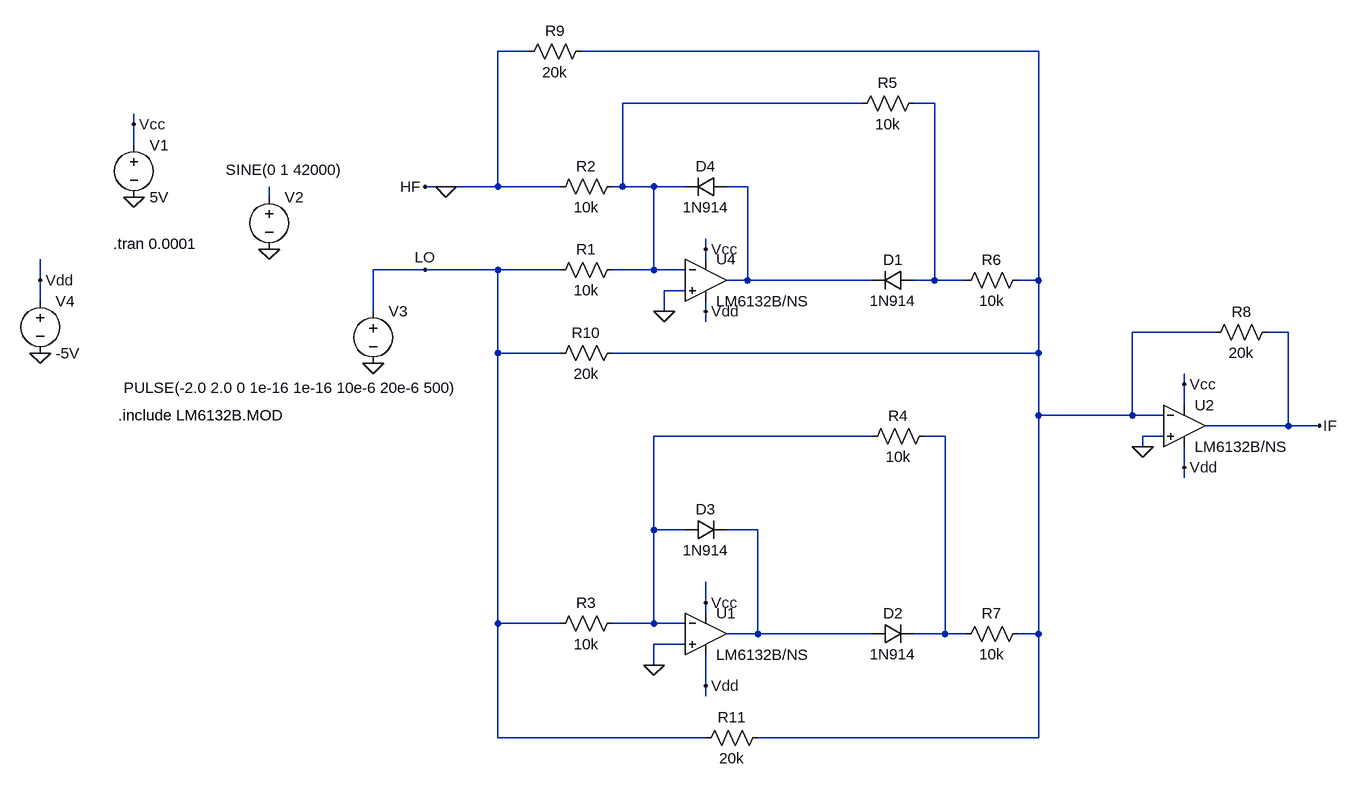
[diagram p0: schematic opamp_mixer.asc]
opamp_mixer.asc, the LTspice schematic file:
Version 4
SHEET 1 1280 752
WIRE -128 -352 -176 -352
WIRE 656 -352 -48 -352
WIRE 384 -272 16 -272
WIRE 496 -272 464 -272
WIRE -736 -240 -736 -256
WIRE -736 -208 -736 -240
WIRE -256 -144 -288 -144
WIRE -176 -144 -176 -352
WIRE -176 -144 -256 -144
WIRE -80 -144 -176 -144
WIRE 16 -144 16 -272
WIRE 16 -144 0 -144
WIRE 64 -144 16 -144
WIRE 112 -144 64 -144
WIRE 208 -144 176 -144
WIRE -528 -128 -528 -144
WIRE 144 -48 144 -64
WIRE 144 -32 144 -48
WIRE -288 -16 -368 -16
WIRE -176 -16 -288 -16
WIRE -80 -16 -176 -16
WIRE 64 -16 64 -144
WIRE 64 -16 0 -16
WIRE 112 -16 64 -16
WIRE -880 0 -880 -32
WIRE 208 0 208 -144
WIRE 208 0 176 0
WIRE 400 0 208 0
WIRE 496 0 496 -272
WIRE 496 0 464 0
WIRE 544 0 496 0
WIRE 656 0 656 -352
WIRE 656 0 624 0
WIRE 112 16 80 16
WIRE -880 32 -880 0
WIRE -368 48 -368 -16
WIRE 80 48 80 16
WIRE 144 48 144 32
WIRE 144 64 144 48
WIRE 928 80 800 80
WIRE 1040 80 1008 80
WIRE -176 112 -176 -16
WIRE -80 112 -176 112
WIRE 656 112 656 0
WIRE 656 112 0 112
WIRE 880 160 880 144
WIRE 880 192 880 160
WIRE 656 208 656 112
WIRE 800 208 800 80
WIRE 800 208 656 208
WIRE 848 208 800 208
WIRE 1040 224 1040 80
WIRE 1040 224 912 224
WIRE 1088 224 1040 224
WIRE 400 240 64 240
WIRE 512 240 480 240
WIRE 848 240 816 240
WIRE 816 256 816 240
WIRE 880 288 880 256
WIRE 880 304 880 288
WIRE 64 384 64 240
WIRE 112 384 64 384
WIRE 224 384 176 384
WIRE 144 496 144 464
WIRE 144 512 144 496
WIRE -176 528 -176 112
WIRE -80 528 -176 528
WIRE 64 528 64 384
WIRE 64 528 0 528
WIRE 112 528 64 528
WIRE 224 544 224 384
WIRE 224 544 176 544
WIRE 400 544 224 544
WIRE 512 544 512 240
WIRE 512 544 464 544
WIRE 544 544 512 544
WIRE 656 544 656 208
WIRE 656 544 624 544
WIRE 112 560 64 560
WIRE 64 592 64 560
WIRE 144 624 144 576
WIRE 144 640 144 624
WIRE -176 704 -176 528
WIRE 144 704 -176 704
WIRE 656 704 656 544
WIRE 656 704 224 704
FLAG -736 -128 0
FLAG -736 -240 Vcc
FLAG 144 -48 Vcc
FLAG 144 496 Vcc
FLAG 880 160 Vcc
FLAG 80 48 0
FLAG 64 592 0
FLAG 816 256 0
FLAG -288 -144 HF
FLAG -288 -16 LO
FLAG 1088 224 IF
FLAG -368 128 0
FLAG -528 -48 0
FLAG -880 112 0
FLAG -880 0 Vdd
FLAG 144 48 Vdd
FLAG 144 624 Vdd
FLAG 880 288 Vdd
FLAG -256 -144 0
SYMBOL diode 464 -16 R90
WINDOW 0 0 32 VBottom 2
WINDOW 3 32 32 VTop 2
SYMATTR InstName D1
SYMATTR Value 1N914
SYMBOL diode 400 560 R270
WINDOW 0 32 32 VTop 2
WINDOW 3 0 32 VBottom 2
SYMATTR InstName D2
SYMATTR Value 1N914
SYMBOL diode 112 400 R270
WINDOW 0 32 32 VTop 2
WINDOW 3 0 32 VBottom 2
SYMATTR InstName D3
SYMATTR Value 1N914
SYMBOL diode 176 -160 R90
WINDOW 0 0 32 VBottom 2
WINDOW 3 32 32 VTop 2
SYMATTR InstName D4
SYMATTR Value 1N914
SYMBOL voltage -736 -224 R0
WINDOW 123 0 0 Left 2
WINDOW 39 0 0 Left 2
SYMATTR InstName V1
SYMATTR Value 5V
SYMBOL res 16 -32 R90
WINDOW 0 0 56 VBottom 2
WINDOW 3 32 56 VTop 2
SYMATTR InstName R1
SYMATTR Value 10k
SYMBOL res 16 -160 R90
WINDOW 0 0 56 VBottom 2
WINDOW 3 32 56 VTop 2
SYMATTR InstName R2
SYMATTR Value 10k
SYMBOL res 16 512 R90
WINDOW 0 0 56 VBottom 2
WINDOW 3 32 56 VTop 2
SYMATTR InstName R3
SYMATTR Value 10k
SYMBOL res 496 224 R90
WINDOW 0 0 56 VBottom 2
WINDOW 3 32 56 VTop 2
SYMATTR InstName R4
SYMATTR Value 10k
SYMBOL res 480 -288 R90
WINDOW 0 0 56 VBottom 2
WINDOW 3 32 56 VTop 2
SYMATTR InstName R5
SYMATTR Value 10k
SYMBOL res 640 -16 R90
WINDOW 0 0 56 VBottom 2
WINDOW 3 32 56 VTop 2
SYMATTR InstName R6
SYMATTR Value 10k
SYMBOL res 640 528 R90
WINDOW 0 0 56 VBottom 2
WINDOW 3 32 56 VTop 2
SYMATTR InstName R7
SYMATTR Value 10k
SYMBOL res 1024 64 R90
WINDOW 0 0 56 VBottom 2
WINDOW 3 32 56 VTop 2
SYMATTR InstName R8
SYMATTR Value 20k
SYMBOL res -32 -368 R90
WINDOW 0 0 56 VBottom 2
WINDOW 3 32 56 VTop 2
SYMATTR InstName R9
SYMATTR Value 20k
SYMBOL res 16 96 R90
WINDOW 0 0 56 VBottom 2
WINDOW 3 32 56 VTop 2
SYMATTR InstName R10
SYMATTR Value 20k
SYMBOL voltage -528 -144 R0
WINDOW 3 -67 -26 Left 2
WINDOW 123 0 0 Left 2
WINDOW 39 0 0 Left 2
SYMATTR Value SINE(0 1 42000)
SYMATTR InstName V2
SYMBOL voltage -368 32 R0
WINDOW 3 -384 133 Left 2
WINDOW 123 0 0 Left 2
WINDOW 39 0 0 Left 2
SYMATTR Value PULSE(-2.0 2.0 0 1e-16 1e-16 10e-6 20e-6 500)
SYMATTR InstName V3
SYMBOL res 240 688 R90
WINDOW 0 0 56 VBottom 2
WINDOW 3 32 56 VTop 2
SYMATTR InstName R11
SYMATTR Value 20k
SYMBOL voltage -880 16 R0
WINDOW 123 0 0 Left 2
WINDOW 39 0 0 Left 2
SYMATTR InstName V4
SYMATTR Value -5V
SYMBOL Opamps\\opamp2 144 -64 R0
SYMATTR InstName U4
SYMATTR Value LM6132B/NS
SYMBOL Opamps\\opamp2 144 480 R0
SYMATTR InstName U1
SYMATTR Value LM6132B/NS
SYMBOL Opamps\\opamp2 880 160 R0
SYMATTR InstName U2
SYMATTR Value LM6132B/NS
TEXT -768 -56 Left 2 !.tran 0.0001
TEXT -760 208 Left 2 !.include LM6132B.MOD

The netlist it stands for:
* opamp_mixer.asc
D1 N003 N004 1N914
D2 N008 N007 1N914
D3 N006 N008 1N914
D4 N004 N002 1N914
V1 Vcc 0 5V
R1 N002 LO 10k
R2 N002 0 10k
R3 N006 LO 10k
R4 N007 N006 10k
R5 N003 N002 10k
R6 N001 N003 10k
R7 N001 N007 10k
R8 IF N001 20k
R9 N001 0 20k
R10 N001 LO 20k
V2 N005 0 SINE(0 1 42000)
V3 LO 0 PULSE(-2.0 2.0 0 1e-16 1e-16 10e-6 20e-6 500)
R11 N001 LO 20k
V4 Vdd 0 -5V
XU4 0 N002 Vcc Vdd N004 LM6132B/NS  ; pins In+ In- V+ V- OUT
XU1 0 N006 Vcc Vdd N008 LM6132B/NS  ; pins In+ In- V+ V- OUT
XU2 0 N001 Vcc Vdd IF LM6132B/NS  ; pins In+ In- V+ V- OUT
.model D D
.lib standard.dio
.tran 0.0001
.include LM6132B.MOD
.backanno
.end